# EAGLE schematic plen_headboard (EAGLE 6.6.0)
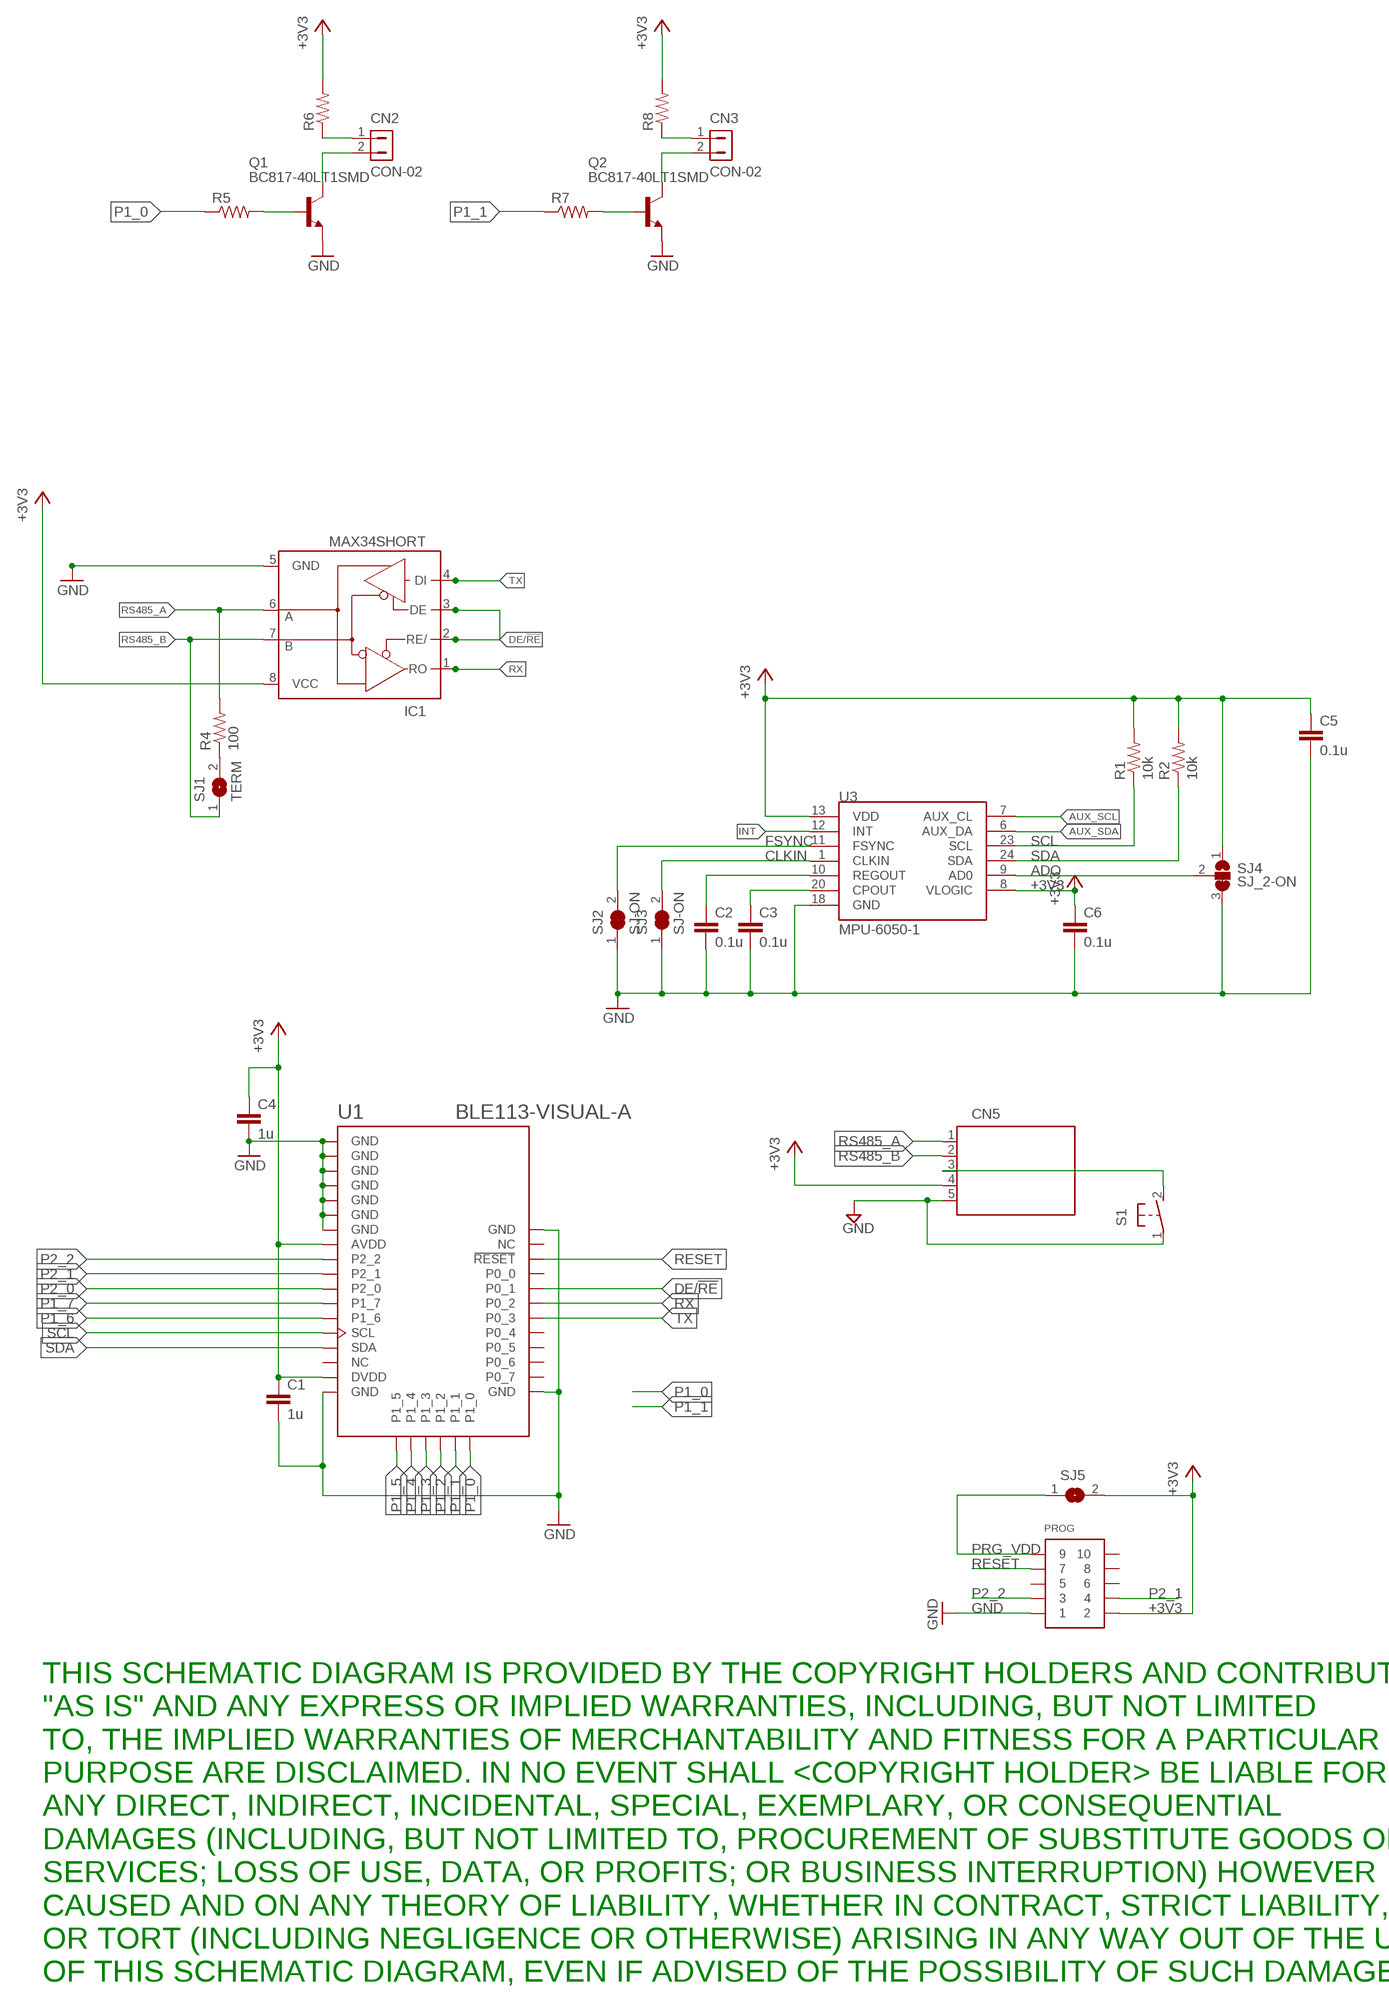
[diagram p0: schematic, sheet 1]

## Parts
C1  1u  C-EUC0603  [C0603]
C2  0.1u  C-EUC0603  [C0603]
C3  0.1u  C-EUC0603  [C0603]
C4  1u  C-EUC0603  [C0603]
C5  0.1u  C-EUC0603  [C0603]
C6  0.1u  C-EUC0603  [C0603]
CN2  CON-02  [SIP-100-02]
CN3  CON-02  [SIP-100-02]
CN5  5PINZH  [ZH-5]
IC1  MAX34SHORT  [SO08SHORT]
PROG  CONN_5-2-FTSH-V  [FTSH-105-DV]
Q1  BC817-40LT1SMD  [SOT23-BEC]
Q2  BC817-40LT1SMD  [SOT23-BEC]
R1  10k  R-US_R0603  [R0603]
R2  10k  R-US_R0603  [R0603]
R4  100  R-US_R0603  [R0603]
R5  R-US_R0603  [R0603]
R6  R-US_R0603  [R0603]
R7  R-US_R0603  [R0603]
R8  R-US_R0603  [R0603]
S1  31-XX  [B3F-31XX]
SJ1  TERM  SJ  [SJ]
SJ2  SJ-ON  [SJ-ON]
SJ3  SJ-ON  [SJ-ON]
SJ4  SJ_2-ON  [SJ_2-ON]
SJ5  SJ  [SJ]
U1  BLE113-VISUAL-A  [BLE113-A]
U3  MPU-6050-1  [QFN-24-4MM2]

## Nets
+3V3: C1.1 C4.1 C5.1 C6.1 CN5.4 IC1.8(VCC) PROG.2 R1.2 R2.2 R6.2 R8.2 SJ4.1 SJ5.2 U1.AVDD U1.DVDD U3.8(VLOGIC) U3.13(VDD)
ADO: SJ4.2 U3.9(AD0)
AUX_SCL: U3.7(AUX_CL)
AUX_SDA: U3.6(AUX_DA)
CLKIN: SJ3.2 U3.1(CLKIN)
DE/!RE: IC1.2(RE/) IC1.3(DE) U1.P0_1
FSYNC: SJ2.2 U3.11(FSYNC)
GND: C1.2 C2.2 C3.2 C4.2 C5.2 C6.2 CN5.5 IC1.5(GND) PROG.1 Q1.E Q2.E S1.1(P) SJ2.1 SJ3.1 SJ4.3 U1.GND U1.GND@2(GND) U1.GND@3(GND) U1.GND@4(GND) U1.GND@5(GND) U1.GND@6(GND) U1.GND@7(GND) U1.GND@8(GND) U1.GND@9(GND) U1.GND@10(GND) U3.18(GND)
INT: U3.12(INT)
N$3: C3.1 U3.20(CPOUT)
N$5: C2.1 U3.10(REGOUT)
N$7: R4.1 SJ1.2
N$10: Q1.B R5.2
N$11: CN2.2 Q1.C
N$13: CN2.1 R6.1
N$14: Q2.B R7.2
N$15: CN3.2 Q2.C
N$16: CN3.1 R8.1
N$17: CN5.3 S1.2(S)
P1_0: R5.1 U1.P1_0
P1_1: R7.1 U1.P1_1
P1_2: U1.P1_2
P1_3: U1.P1_3
P1_4: U1.P1_4
P1_5: U1.P1_5
P1_6: U1.P1_6
P1_7: U1.P1_7
P2_0: U1.P2_0
P2_1: PROG.4 U1.P2_1
P2_2: PROG.3 U1.P2_2
PRG_VDD [power]: PROG.9 SJ5.1
RESET: PROG.7 U1.RESET
RS485_A: CN5.1 IC1.6(A) R4.2
RS485_B: CN5.2 IC1.7(B) SJ1.1
RX: IC1.1(RO) U1.P0_2
SCL: R1.1 U1.SCL U3.23(SCL)
SDA: R2.1 U1.SDA U3.24(SDA)
TX: IC1.4(DI) U1.P0_3
Unconnected: PROG.5 PROG.6 PROG.8 PROG.10 U1.NC U1.NC@2(NC) U1.P0_0 U1.P0_4 U1.P0_5 U1.P0_6 U1.P0_7

## Notes on the sheet
- THIS SCHEMATIC DIAGRAM IS PROVIDED BY THE COPYRIGHT HOLDERS AND CONTRIBUTORS 
  "AS IS" AND ANY EXPRESS OR IMPLIED WARRANTIES, INCLUDING, BUT NOT LIMITED 
  TO, THE IMPLIED WARRANTIES OF MERCHANTABILITY AND FITNESS FOR A PARTICULAR 
  PURPOSE ARE DISCLAIMED. IN NO EVENT SHALL <COPYRIGHT HOLDER> BE LIABLE FOR 
  ANY DIRECT, INDIRECT, INCIDENTAL, SPECIAL, EXEMPLARY, OR CONSEQUENTIAL 
  DAMAGES (INCLUDING, BUT NOT LIMITED TO, PROCUREMENT OF SUBSTITUTE GOODS OR 
  SERVICES; LOSS OF USE, DATA, OR PROFITS; OR BUSINESS INTERRUPTION) HOWEVER 
  CAUSED AND ON ANY THEORY OF LIABILITY, WHETHER IN CONTRACT, STRICT LIABILITY,
  OR TORT (INCLUDING NEGLIGENCE OR OTHERWISE) ARISING IN ANY WAY OUT OF THE USE
  OF THIS SCHEMATIC DIAGRAM, EVEN IF ADVISED OF THE POSSIBILITY OF SUCH DAMAGE.

## Library data of the parts
C1-C6 = rcl:C-EU: CAPACITOR, European symbol
CN2 CN3 = con-headers-jp:CON-02
CN5 = con-jst:5PIN
IC1 = maxim:MAX34*: +5V, Fail-Safe, 40Mbps, Profibus RS-485/RS-422 Transceivers Source: MAX3465-MAX3469.pdf
PROG = pel_misc:CONN_5-2
Q1 Q2 = transistor-npn:BC817*: NPN Transistor
R1 R2 R4-R8 = rcl:R-US_: RESISTOR, American symbol
S1 = switch-omron:31-XX: OMRON SWITCH; MPN: B3F-3100; OC_FARNELL: 959704; OC_NEWARK: 36M3582
SJ1 SJ5 = jumper:SJ: SMD solder JUMPER
SJ2 SJ3 = jumper:SJ-ON
SJ4 = jumper:SJ_2-ON
U1 = sf-bluegiga:BLE113-VISUAL: Bluetooth Low Energy single-mode module - Bluetooth 4.0 (CC2541). BLE113-A variant has an on-module ceramic chip antenna. BLE113-A variant includes keepout/restrict area. Antenna edge of the module should be flush up against the edge of the PCB. See datasheet for variant layout details. The BLE113 is a Bluetooth Smart module targeted for small and low-power sensors and accessories. It integrates all features required for a Bluetooth Smart application, including Bluetooth radio, software stack, and GATT-based profiles. The BLE113 Bluetooth Smart module can also host end-user applications, which means no external micro controller is required in size or price constrained devices. Moreover, it has flexible hardware interfaces to connect to different peripherals and sensors and can be powered directly from a standard 3V coin cell battery or a pair of AAA batteries. In the lowest power sleep mode it merely consumes 500 nA and will wake up within a few hundred microseconds. The BLE113 Bluetooth Smart module conusmer approximately 30% less power and is smaller than the BLE112 Bluetooth Smart Module. http://www.bluegiga.com/en-US/products/bluetooth-4.0-modules/ble113-bluetooth--smart-module https://github.com/jrowberg/sf-oshw Last updated 2014-01-04 by Jeff Rowberg <jeff@rowberg.net>; ANTENNA: On-module ceramic chip antenna
U3 = Testing:MPU-6050

## Net classes
1 power: width 0.254 mm, drill 0.33 mm, clearance 0.152 mm